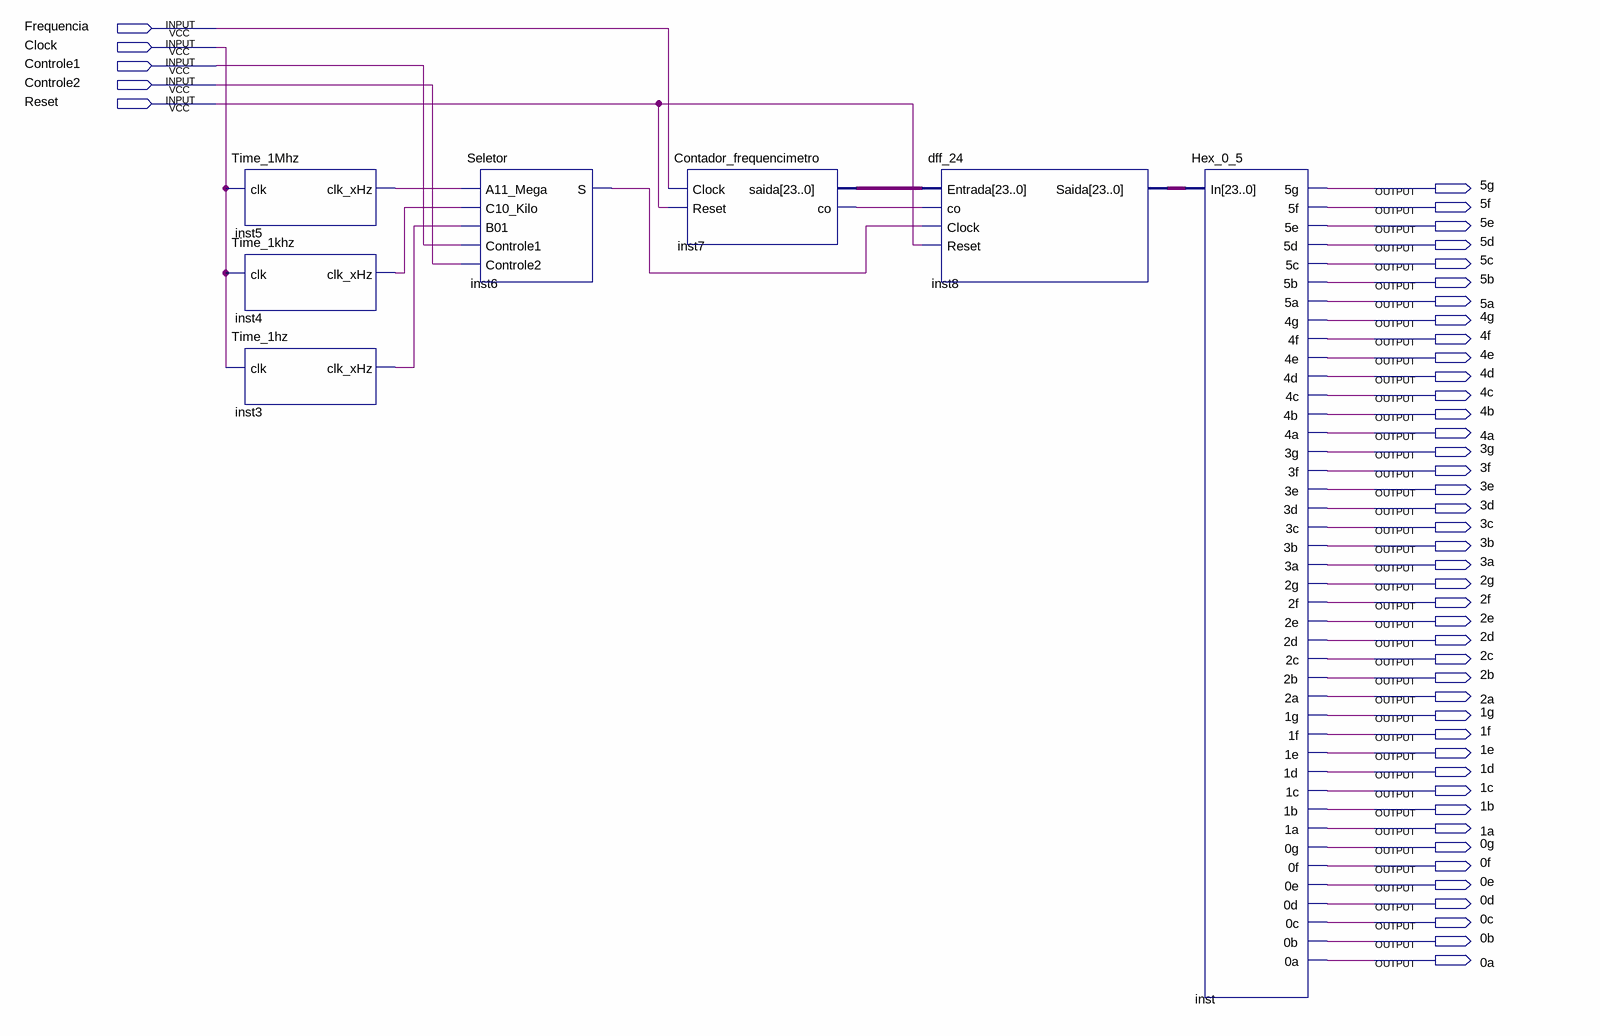
[diagram p0: schematic sheet]
// Quartus schematic Projeto_final.bdf as structural Verilog: 7 symbols, 47 pins
module Projeto_final (
  input  Frequencia,
  input  Clock,
  input  Controle1,
  input  Controle2,
  input  Reset,
  output \5g ,
  output \5f ,
  output \5e ,
  output \5d ,
  output \5c ,
  output \5b ,
  output \5a ,
  output \4g ,
  output \4f ,
  output \4e ,
  output \4d ,
  output \4c ,
  output \4b ,
  output \4a ,
  output \3g ,
  output \3f ,
  output \3e ,
  output \3d ,
  output \3c ,
  output \3b ,
  output \3a ,
  output \2g ,
  output \2f ,
  output \2e ,
  output \2d ,
  output \2c ,
  output \2b ,
  output \2a ,
  output \1g ,
  output \1f ,
  output \1e ,
  output \1d ,
  output \1c ,
  output \1b ,
  output \1a ,
  output \0g ,
  output \0f ,
  output \0e ,
  output \0d ,
  output \0c ,
  output \0b ,
  output \0a 
);

  wire inst3_clk_xhz, inst4_clk_xhz, inst5_clk_xhz, inst6_s, inst7_co;
  wire [23:0] inst7_saida, inst8_saida;

  Time_1Mhz inst5 (.clk(Clock), .clk_xHz(inst5_clk_xhz));
  Time_1khz inst4 (.clk(Clock), .clk_xHz(inst4_clk_xhz));
  Time_1hz inst3 (.clk(Clock), .clk_xHz(inst3_clk_xhz));
  Seletor inst6 (
    .A11_Mega(inst5_clk_xhz), .C10_Kilo(inst4_clk_xhz), .B01(inst3_clk_xhz), .Controle1(Controle1),
    .Controle2(Controle2), .S(inst6_s));
  Contador_frequencimetro inst7 (.Clock(Frequencia), .Reset(Reset), .saida(inst7_saida), .co(inst7_co));
  dff_24 inst8 (.Entrada(inst7_saida), .co(inst7_co), .Clock(inst6_s), .Reset(Reset), .Saida(inst8_saida));
  Hex_0_5 inst (
    .In(inst8_saida), .\5g (\5g ), .\5f (\5f ), .\5e (\5e ), .\5d (\5d ), .\5c (\5c ), .\5b (\5b ),
    .\5a (\5a ), .\4g (\4g ), .\4f (\4f ), .\4e (\4e ), .\4d (\4d ), .\4c (\4c ), .\4b (\4b ), .\4a (\4a ),
    .\3g (\3g ), .\3f (\3f ), .\3e (\3e ), .\3d (\3d ), .\3c (\3c ), .\3b (\3b ), .\3a (\3a ), .\2g (\2g ),
    .\2f (\2f ), .\2e (\2e ), .\2d (\2d ), .\2c (\2c ), .\2b (\2b ), .\2a (\2a ), .\1g (\1g ), .\1f (\1f ),
    .\1e (\1e ), .\1d (\1d ), .\1c (\1c ), .\1b (\1b ), .\1a (\1a ), .\0g (\0g ), .\0f (\0f ), .\0e (\0e ),
    .\0d (\0d ), .\0c (\0c ), .\0b (\0b ), .\0a (\0a ));
endmodule
